# Altium schematic sheet Driver Morpheus v4.0 CENTRAL.SchDoc
size A4
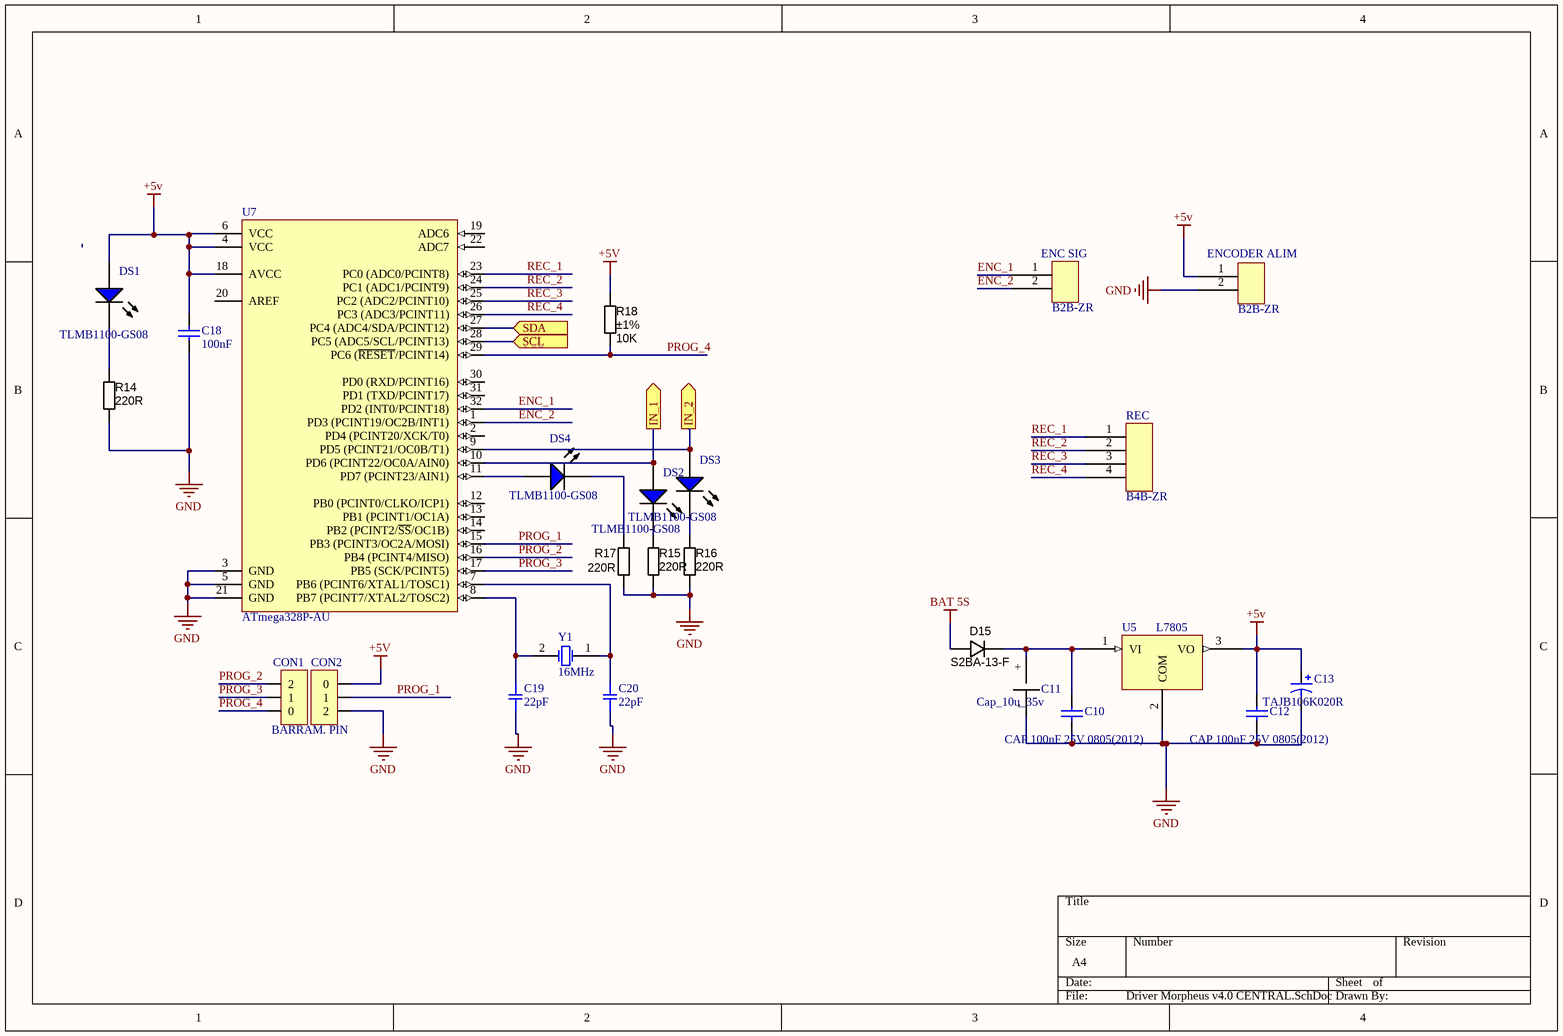
[diagram p0: Driver Morpheus v4.0 CENTRAL.SchDoc]

## Parts
C10  CAP 100nF 25V 0805(2012)  [CAPC0805(2012)145_M]
C11  Cap_10u_35v  [CAP_100u_25v_Tantalum]
C12  CAP 100nF 25V 0805(2012)  [CAPC0805(2012)145_M]
C13  TAJB106K020R  [AVX-CAPC3528_V]
C18  value 100nF  [CAP-0402]  (hidden comment: GRM155R71C104KA88D)
C19  22pF  [SMD-0603C]
C20  22pF  [SMD-0603C]
CON1  BARRAM. PIN  [1x3POS_HEADER]
CON2  (no value)  [1x3POS_HEADER]
D15  Manufacturer Part Number 1: S2BA-13-F  [DO-214AC]  (hidden comment: 100V; 1.5A)
DS1  TLMB1100-GS08  [VISH-TLMX1100-2_V]
DS2  TLMB1100-GS08  [VISH-TLMX1100-2_V]
DS3  TLMB1100-GS08  [VISH-TLMX1100-2_V]
DS4  TLMB1100-GS08  [VISH-TLMX1100-2_V]
ENC_SIG  B2B-ZR  [B2B-ZR]
ENCODER_ALIM  B2B-ZR  [B2B-ZR]
R14  value 220R  [RESC1608X55N]  (hidden comment: Thick Film)
R15  value 220R  [RESC1608X55N]  (hidden comment: Thick Film)
R16  value 220R  [RESC1608X55N]  (hidden comment: Thick Film)
R17  value 220R  [RESC1608X55N]  (hidden comment: Thick Film)
R18  value 10K  Tolerance: ±1%  [RESC1608X55N]  (hidden comment: Thick Film)
REC  B4B-ZR  [B4B-ZR]
U5  L7805  [D2PAK-3]
U7  ATmega328P-AU  [32A_N]
Y1  16MHz  [CRYSTAL_HC49-US-SM]

## Ports
IN_1 (out), IN_2 (out), SCL (in), SDA (in)

## Nets
+5V: C12.2 C13.1 C18.1 CON2.0 DS1.1(A) ENCODER_ALIM.1 R18.1 U5.3(VO) U7.4(VCC) U7.6(VCC) U7.18(AVCC)
BAT 5S: D15.A
GND: C10.1 C11.- C12.1 C13.2 C18.2 C19.1 C20.1 CON2.2 ENCODER_ALIM.2 R14.2 R15.2 R16.2 R17.2 U5.2(COM) U7.3(GND) U7.5(GND) U7.21(GND)
ENC_1: ENC_SIG.1 U7.32(PD2_(INT0/PCINT18))
ENC_2: ENC_SIG.2 U7.1(PD3_(PCINT19/OC2B/INT1))
IN_1: DS2.1(A) U7.10(PD6_(PCINT22/OC0A/AIN0)) ; port IN_1
IN_2: DS3.1(A) U7.9(PD5_(PCINT21/OC0B/T1)) ; port IN_2
PROG_1: CON2.1 U7.15(PB3_(PCINT3/OC2A/MOSI))
PROG_2: CON1.2 U7.16(PB4_(PCINT4/MISO))
PROG_3: CON1.1 U7.17(PB5_(SCK/PCINT5))
PROG_4: CON1.0 R18.2 U7.29(PC6_(~{RESET}/PCINT14))
REC_1: REC.1 U7.23(PC0_(ADC0/PCINT8))
REC_2: REC.2 U7.24(PC1_(ADC1/PCINT9))
REC_3: REC.3 U7.25(PC2_(ADC2/PCINT10))
REC_4: REC.4 U7.26(PC3_(ADC3/PCINT11))
SCL: U7.28(PC5_(ADC5/SCL/PCINT13)) ; port SCL
SDA: U7.27(PC4_(ADC4/SDA/PCINT12)) ; port SDA
NetC10_2: C10.2 C11.+ D15.K U5.1(VI)
NetC19_2: C19.2 U7.8(PB7_(PCINT7/XTAL2/TOSC2)) Y1.2(OSC2)
NetC20_2: C20.2 U7.7(PB6_(PCINT6/XTAL1/TOSC1)) Y1.1(OSC1)
NetDS1_2: DS1.2(K) R14.1
NetDS2_2: DS2.2(K) R15.1
NetDS3_2: DS3.2(K) R16.1
NetDS4_1: DS4.1(A) U7.11(PD7_(PCINT23/AIN1))
NetDS4_2: DS4.2(K) R17.1

Not connected (* = marked no-connect by the designer): U7 2(PD4_(PCINT20/XCK/T0)) 12(PB0_(PCINT0/CLKO/ICP1)) 13(PB1_(PCINT1/OC1A)) 14(PB2_(PCINT2/~{SS}/OC1B)) 19(ADC6) 20(AREF) 22(ADC7) 30(PD0_(RXD/PCINT16)) 31(PD1_(TXD/PCINT17))

## Library data of the parts
C10 C12 = CMP-1036-04408-1: CAP 100nF 25V ±5% 0805 (2012 Metric) Thickness 1.45mm SMD; Case-Metric: 2012; Case-EIA: 0805; Tolerance: Â±5%; Value: 100nF; Rated Voltage: 25 V; Max Thickness: 1.45 mm; Technology: SMT
C13 = CMP-0279-00001-1: Capacitor, Tantalum, 10uF 10% 20V MCCT-B (3528); Manufacturer: AVX; Polarity: Polarized; PartNumber: TAJB106K020R; PackageDescription: 2-Pin SMT Capacitor, 3.5 x 2.8 mm Body; ComponentLink1URL: http://www.avx.com/; PackageReference: CAPC3528; ComponentLink2Description: Datasheet; Capacitance: 10uF; Technology: Tantalum; ComponentLink2URL: http://www.avx.com/docs/Catalogs/taj.pdf; Tolerance: 10%; ComponentLink1Description: Manufacturer URL; Rated Voltage: 20V; DatasheetVersion: Jun-13; Mounting Technology: Surface Mount
C18 = Cap 100nF 0402: 0.10µF 16V Ceramic Capacitor X7R 0402 (1005 Metric) 0.039" L x 0.020" W (1.00mm x 0.50mm)
C19 C20 = GQM1885C1H220GB01D: CAP CER 22PF 50V NP0 0603; Manufacturer: Murata Electronics North America; Factory Stock: 0; Unit Price (USD): 1,07; Minimum Quantity: 1; Tolerance: ±2%; Temperature Coefficient: C0G, NP0; Part Number: GQM1885C1H220GB01D; Datasheets: http://www.murata.com/~/media/webrenewal/support/library/catalog/products/capacitor/mlcc/c02e.pdf; Image: //media.digikey.com/Renders/Murata%20Renders/0603%28LQG18%29.jpg; Digi-Key Part Number: 490-6089-1-ND; Quantity Available: 2359; @ qty: 0; Packaging: Cut Tape (CT); Series: GQM; Part Status: Active; Value: 22pF; Voltage: 50V; Operating Temperature: -55°C ~ 125°C; Features: High Q, Low Loss; Ratings: -; Applications: RF, Microwave, High Frequency; Mounting Type: Surface Mount, MLCC; Package / Case: 0603 (1608 Metric); Size / Dimension: 0.063" L x 0.031" W (1.60mm x 0.80mm); Height - Seated (Max): -; Thickness (Max): 0.035" (0.90mm); Lead Spacing: -; Lead Style: -
CON1 CON2 = 03x01_Conector_Male_Shroudred: CONN HEADER XH TOP 3POS 2.5MM
D15 = DIODE_100V_1.5A_SMA: Diode SMD 100V 1.5A SMA; Manufacturer 1: Diodes Inc; Material: Si; Diode Type: Standard; Value: Vf = 1.15V @ 1.5A (Max); SCDType: source; Package / Case: DO-214AC, SMA; Ratings: 100V; 1.5A; Supplier 1: Digi-Key; Supplier Part Number 1: S2BA-FDICT-ND
DS1 = CMP-1666-00028-1: Red LED, 10 mA, 3.9 V, -40 to 100 degC, 2-Pin SMD (0603), RoHS, Tape and Reel; Tolerance: 10%; Voltage Rating: 100 V; Capacitance: 10 nF; Type (Capacitors): X7R; Case\Package: Radial; ComponentLink1Description: Manufacturer URL; REACH SVHC: No SVHC; Package Quantity: 500; PackageDescription: 2-Pin Surface Mount Device, Body 1.6 x 0.8 mm; Pins: 2; ComponentLink2URL: http://download.siliconexpert.com/pdfs/2016/8/7/12/43/26/667/vsh_/manual/379263299541529tlmb1100.pdf; RoHSCompliant: true; Lead Pitch: 2.54 mm; Height: 2.54 mm; DatasheetVersion: Rev. 2.7, 03/2016; Length: 5.33 mm; ComponentLink1URL: http://www.vishay.com/; Min Operating Temperature: -55 degC; PackageReference: 0603; Packaging: Bulk; ComponentLink2Description: Datasheet; Max Operating Temperature: 125 degC; Radiation Hardening: No; Width: 3.81 mm; Mount: Through Hole
DS2 DS3 = CMP-1666-00028-1: Blue LED, 10 mA, 3.9 V, -40 to 100 degC, 2-Pin SMD (0603), RoHS, Tape and Reel; Tolerance: 10%; Voltage Rating: 100 V; Capacitance: 10 nF; Type (Capacitors): X7R; Case\Package: Radial; ComponentLink1Description: Manufacturer URL; REACH SVHC: No SVHC; Package Quantity: 500; PackageDescription: 2-Pin Surface Mount Device, Body 1.6 x 0.8 mm; Pins: 2; ComponentLink2URL: http://download.siliconexpert.com/pdfs/2016/8/7/12/43/26/667/vsh_/manual/379263299541529tlmb1100.pdf; RoHSCompliant: true; Lead Pitch: 2.54 mm; Height: 2.54 mm; DatasheetVersion: Rev. 2.7, 03/2016; Length: 5.33 mm; ComponentLink1URL: http://www.vishay.com/; Min Operating Temperature: -55 degC; PackageReference: 0603; Packaging: Bulk; ComponentLink2Description: Datasheet; Max Operating Temperature: 125 degC; Radiation Hardening: No; Width: 3.81 mm; Mount: Through Hole
DS4 = CMP-1666-00028-1: Green LED, 10 mA, 3.9 V, -40 to 100 degC, 2-Pin SMD (0603), RoHS, Tape and Reel; Tolerance: 10%; Voltage Rating: 100 V; Capacitance: 10 nF; Type (Capacitors): X7R; Case\Package: Radial; ComponentLink1Description: Manufacturer URL; REACH SVHC: No SVHC; Package Quantity: 500; PackageDescription: 2-Pin Surface Mount Device, Body 1.6 x 0.8 mm; Pins: 2; ComponentLink2URL: http://download.siliconexpert.com/pdfs/2016/8/7/12/43/26/667/vsh_/manual/379263299541529tlmb1100.pdf; RoHSCompliant: true; Lead Pitch: 2.54 mm; Height: 2.54 mm; DatasheetVersion: Rev. 2.7, 03/2016; Length: 5.33 mm; ComponentLink1URL: http://www.vishay.com/; Min Operating Temperature: -55 degC; PackageReference: 0603; Packaging: Bulk; ComponentLink2Description: Datasheet; Max Operating Temperature: 125 degC; Radiation Hardening: No; Width: 3.81 mm; Mount: Through Hole
R14-R17 = RES_220R_0603_5%: Resistor SMD chip 220 Ohm 0.1W 5% 0603; Manufacturer 1: Yageo; Manufacturer Part Number 1: RC0603JR-07220RL; Ratings: 1/10 W; SCDType: spec; Manufacturer 5: Royal Ohm; Manufacturer Part Number 5: 0603WAJ0221; Package / Case: 0603 (1608 metric); Tolerance: ±5%; Material: Thick Film; Supplier 1: Digi-Key; Supplier Part Number 1: 311-220GRCT-ND; Supplier 2: Digi-Key; Supplier Part Number 2: P220GCT-ND; Manufacturer 2: Panasonic Electronic Components; Manufacturer Part Number 2: ERJ-3GEYJ221V; RoHS 2: RoHS Compliant; ComponentLink2URL: http://industrial.panasonic.com/www-cgi/jvcr13pz.cgi?E+PZ+3+AOA0001+ERJ3GEYJ221V+7+WW; ComponentLink2Description: http://industrial.panasonic.com/www-cgi/jvcr13pz.cgi?E+PZ+3+AOA0001+ERJ3GEYJ221V+7+WW; ComponentLink1URL: http://www.yageo.com/documents/recent/PYu-RC0603_51_RoHS_L_4.pdf; ComponentLink1Description: http://www.yageo.com/documents/recent/PYu-RC0603_51_RoHS_L_4.pdf; Supplier 3: Digi-Key; Supplier Part Number 3: RMCF0603JT220RCT-ND; Manufacturer 3: Stackpole Electronics Inc; Manufacturer Part Number 3: RMCF0603JT220R; RoHS 3: RoHS Compliant; ComponentLink3URL: http://www.seielect.com/Catalog/SEI-RMCF_RMCP.pdf; ComponentLink3Description: http://www.seielect.com/Catalog/SEI-RMCF_RMCP.pdf; Supplier 4: Digi-Key; Supplier Part Number 4: RHM220CGCT-ND; Manufacturer 4: Rohm Semiconductor; Manufacturer Part Number 4: MCR03ERTJ221; RoHS 4: RoHS Compliant; ComponentLink4URL: http://rohmfs.rohm.com/en/products/databook/datasheet/passive/resistor/chip_resistor/mcr_g.pdf; ComponentLink4Description: http://rohmfs.rohm.com/en/products/databook/datasheet/passive/resistor/chip_resistor/mcr_g.pdf; RoHS 1: RoHS Compliant
R18 = RES_10K_0603_1%: Resistor SMD chip 10k Ohm 0.1W 1% 0603; Manufacturer 1: Yageo; Manufacturer Part Number 1: RC0603FR-0710KL; Ratings: 1/10W; SCDType: spec; Package / Case: 0603 (1608 Metric); Supplier 1: Digi-Key; Supplier Part Number 1: 311-10.0KHRCT-ND
U5 = LM7805
U7 = ATmega328P-AU: 8-bit AVR Microcontroller, 32KB Flash, 1KB EEPROM, 2KB SRAM, 32-pin TQFP, Industrial Grade (-40°C to 85°C); DatasheetVersion: revD, May-2011; PackageVersion: revC, Oct-2010; PackageReference: 32A; PackageDescription: 32-Lead, 7x7x1.0 mm Body, 0.8mm Lead Pitch, Thin Profile Plastic Quad Flat Package (TQFP); Code_JEDEC: MS-026-ABA; ComponentLink1Description: Manufacturer URL; ComponentLink1URL: http://www.atmel.com/; ComponentLink2Description: ATmega48A/48PA/88A/88PA/168A/168PA/328/328P Datasheet; ComponentLink2URL: http://www.atmel.com/dyn/resources/prod_documents/doc8271.pdf; ComponentLink3Description: ATmega48A/48PA/88A/88PA/168A/168PA/328/328P Summary; ComponentLink3URL: http://www.atmel.com/dyn/resources/prod_documents/8271S.pdf
Y1 = XTAL: Crystal Oscillator; Published: 8-Jun-2000; LatestRevisionDate: 17-Jul-2002; LatestRevisionNote: Re-released for DXP Platform.; PackageReference: R38; Publisher: Altium Limited; PackageDescription: Crystal, Thru-Hole; 2 Leads; Body 3.1 x 8.2 mm (Dia.xH)